# Altium schematic sheet AFC07-S12FCA-00AFC07-S12FCA-00 (1).schdoc
size 127 x 101 mm
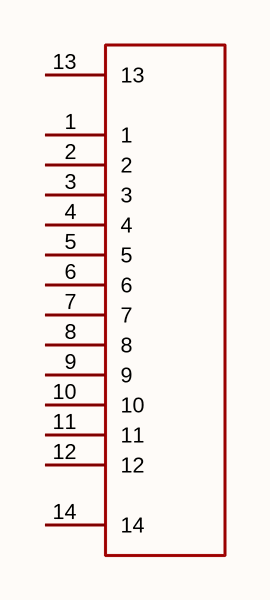
[diagram p0: AFC07-S12FCA-00AFC07-S12FCA-00 (1).schdoc]

## Parts
FPC?  (no value)

## Nets

Not connected (* = marked no-connect by the designer): FPC? 1 2 3 4 5 6 7 8 9 10 11 12 13 14

## Library data of the parts
FPC? = AFC07-S12FCA-00: Symbol: AFC07-S12FCA-00